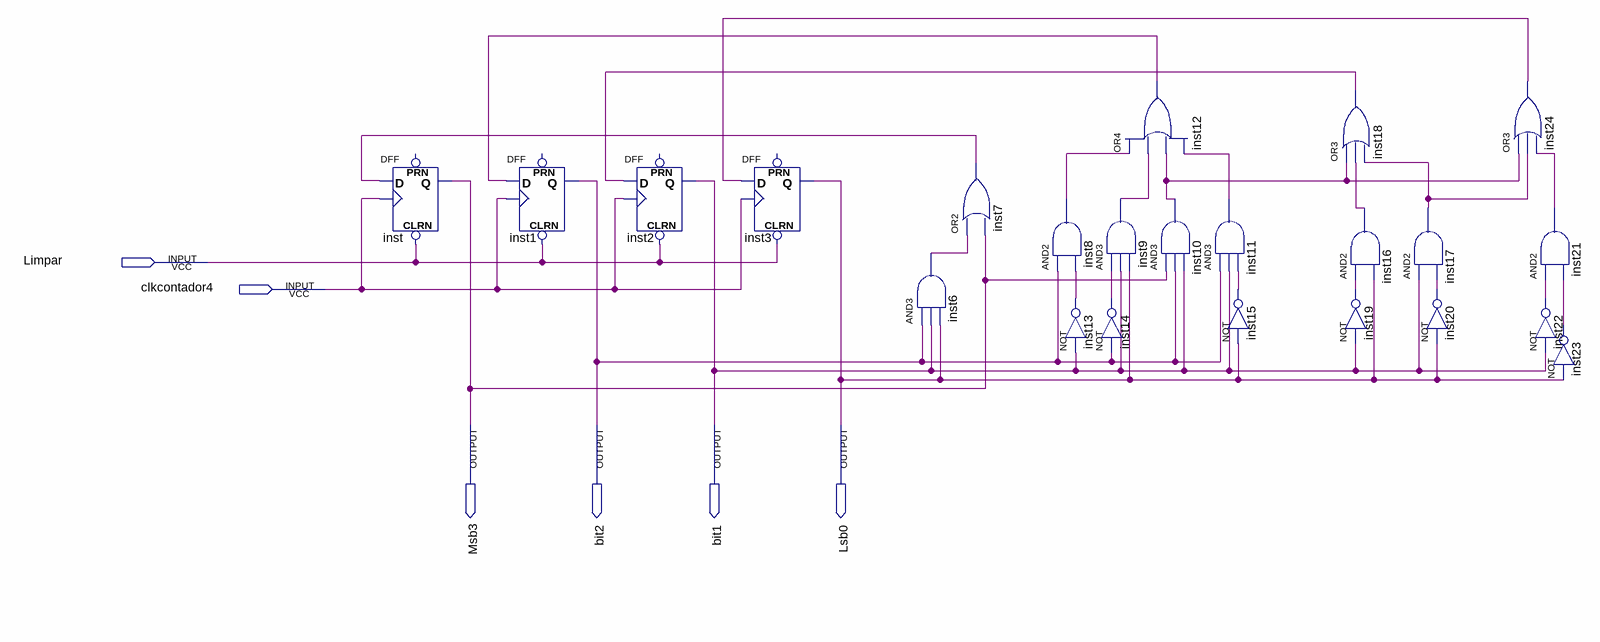
[diagram p0: schematic sheet]
// Quartus schematic ContadorSerie.bdf as structural Verilog: 23 symbols, 6 pins
module ContadorSerie (
  input  Limpar,
  input  clkcontador4,
  output Msb3,
  output bit2,
  output bit1,
  output Lsb0
);

  wire inst6_out, inst7_out, inst8_out, inst9_out, inst10_out, inst11_out, inst12_out, inst13_out,
       inst14_out, inst15_out, inst16_out, inst17_out, inst18_out, inst19_out, inst20_out, inst21_out,
       inst22_out, inst23_out, inst24_out;

  DFF inst (.CLRN(Limpar), .CLK(clkcontador4), .D(inst7_out), .Q(Msb3));  // open: PRN
  DFF inst1 (.CLRN(Limpar), .CLK(clkcontador4), .D(inst12_out), .Q(bit2));  // open: PRN
  DFF inst2 (.CLRN(Limpar), .CLK(clkcontador4), .D(inst18_out), .Q(bit1));  // open: PRN
  DFF inst3 (.CLRN(Limpar), .CLK(clkcontador4), .D(inst24_out), .Q(Lsb0));  // open: PRN
  and inst6 (inst6_out, bit2, bit1, Lsb0);
  or inst7 (inst7_out, inst6_out, Msb3);
  and inst8 (inst8_out, bit2, inst13_out);
  not inst13 (inst13_out, bit1);
  or inst12 (inst12_out, inst8_out, inst9_out, inst10_out, inst11_out);
  and inst9 (inst9_out, inst14_out, bit1, Lsb0);
  not inst14 (inst14_out, bit2);
  and inst10 (inst10_out, Msb3, bit2, bit1);
  and inst11 (inst11_out, bit2, bit1, inst15_out);
  not inst15 (inst15_out, Lsb0);
  or inst18 (inst18_out, inst10_out, inst16_out, inst17_out);
  and inst16 (inst16_out, inst19_out, Lsb0);
  not inst19 (inst19_out, bit1);
  and inst17 (inst17_out, bit1, inst20_out);
  not inst20 (inst20_out, Lsb0);
  or inst24 (inst24_out, inst10_out, inst17_out, inst21_out);
  and inst21 (inst21_out, inst22_out, inst23_out);
  not inst22 (inst22_out, bit1);
  not inst23 (inst23_out, Lsb0);
endmodule
